# EAGLE schematic Receiver (EAGLE 7.6.0)
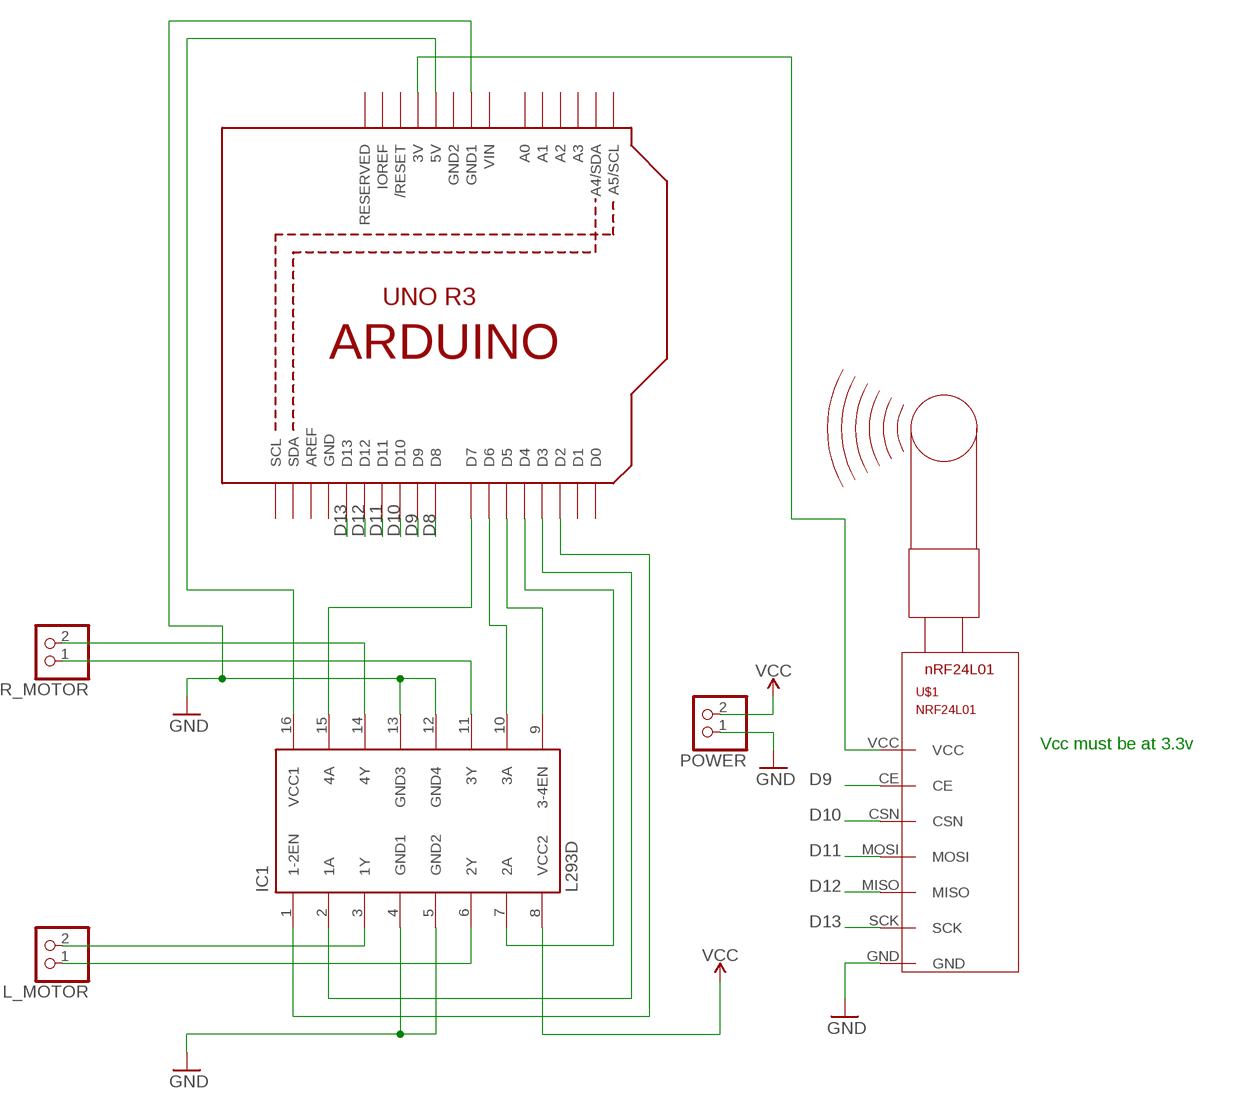
[diagram p0: schematic, sheet 1]

## Parts
IC1  L293D  [DIL16]
L_MOTOR  PINHD-1X2  [1X02]
POWER  PINHD-1X2  [1X02]
R_MOTOR  PINHD-1X2  [1X02]
U1  ARDUINOR3-BPLACE  [ARDUINOR3-BPLACE]
U$1  NRF24L01  [NRF24L01]

## Nets
D8: U1.D8
D9: U1.D9 U$1.CE
D10: U1.D10 U$1.CSN
D11: U1.D11 U$1.MOSI
D12: U1.D12 U$1.MISO
D13: U1.D13 U$1.SCK
GND: IC1.4(GND1) IC1.5(GND2) IC1.12(GND4) IC1.13(GND3) POWER.1 U1.GND1 U$1.GND
N$1: IC1.15(4A) U1.D7
N$2: IC1.10(3A) U1.D6
N$3: IC1.9(3-4EN) U1.D5
N$4: IC1.7(2A) U1.D4
N$5: IC1.2(1A) U1.D3
N$6: IC1.1(1-2EN) U1.D2
N$7: IC1.14(4Y) R_MOTOR.2
N$8: IC1.3(1Y) L_MOTOR.2
N$9: IC1.11(3Y) R_MOTOR.1
N$10: IC1.6(2Y) L_MOTOR.1
N$11: IC1.16(VCC1) U1.5V
N$13: U1.3V U$1.VCC
VCC: IC1.8(VCC2) POWER.2
Unconnected: U1.A0 U1.A1 U1.A2 U1.A3 U1.A4(A4/SDA) U1.A5(A5/SCL) U1.AREF U1.D0 U1.D1 U1.IOREF U1.RESERVED U1.RESET(/RESET) U1.SCL U1.SDA

## Notes on the sheet
- Vcc must be at 3.3v

## Power pins joined to a net without a drawn wire
GND: U1.GND
GND2: U1.GND2
VIN: U1.VIN

## Library data of the parts
IC1 = st-microelectronics:L293D: PUSH-PULL 4 CHANNEL DRIVER; MPN: L293D; OC_FARNELL: 9589619; OC_NEWARK: 56P8249
L_MOTOR POWER R_MOTOR = pinhead:PINHD-1X2: PIN HEADER
U1 = adafruit:ARDUINOR3: This is a new object for the new Arduino R3 - with extra pins that you may want to use (such as IOref, and duplicated A4/A5
U$1 = Clean-Kong (1):NRF24L01: nrF54L01 2.4GHz with 100 Channels Emitter/Reveiver SPI Controlled Roboshop / Minint